# EasyEDA Pro project PCB File.epro

# Board Rev1
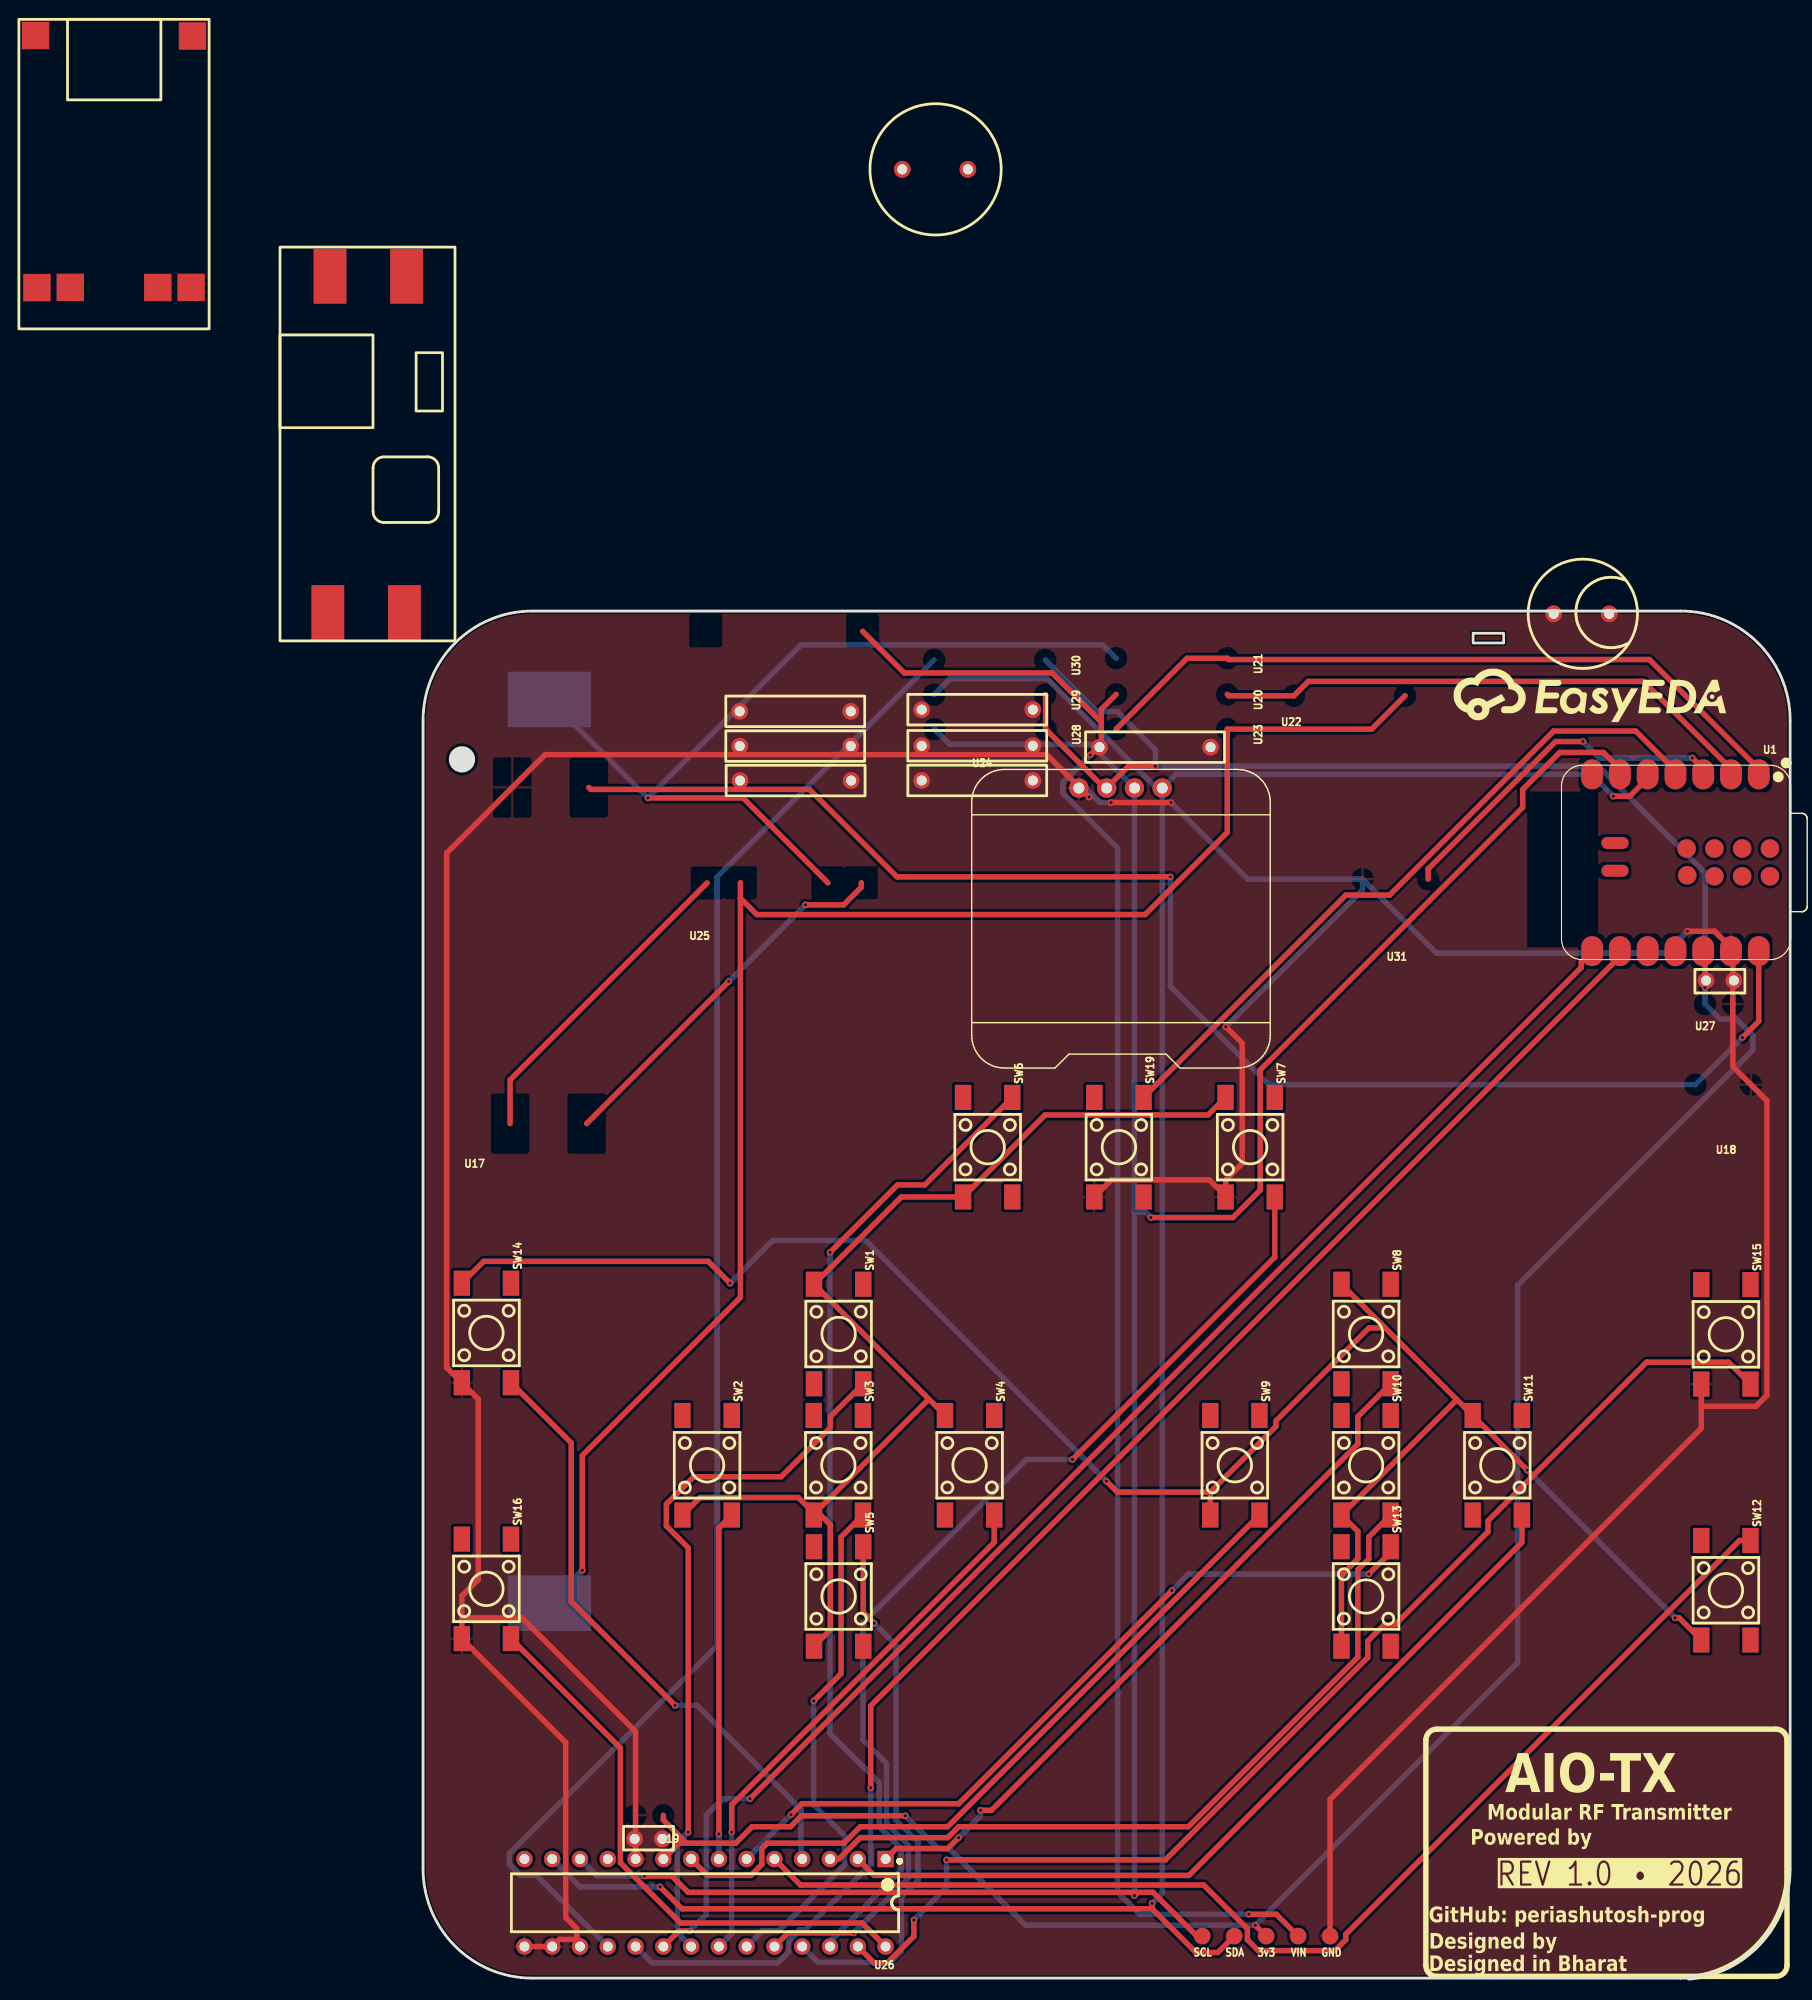
[diagram p0: board, top side]
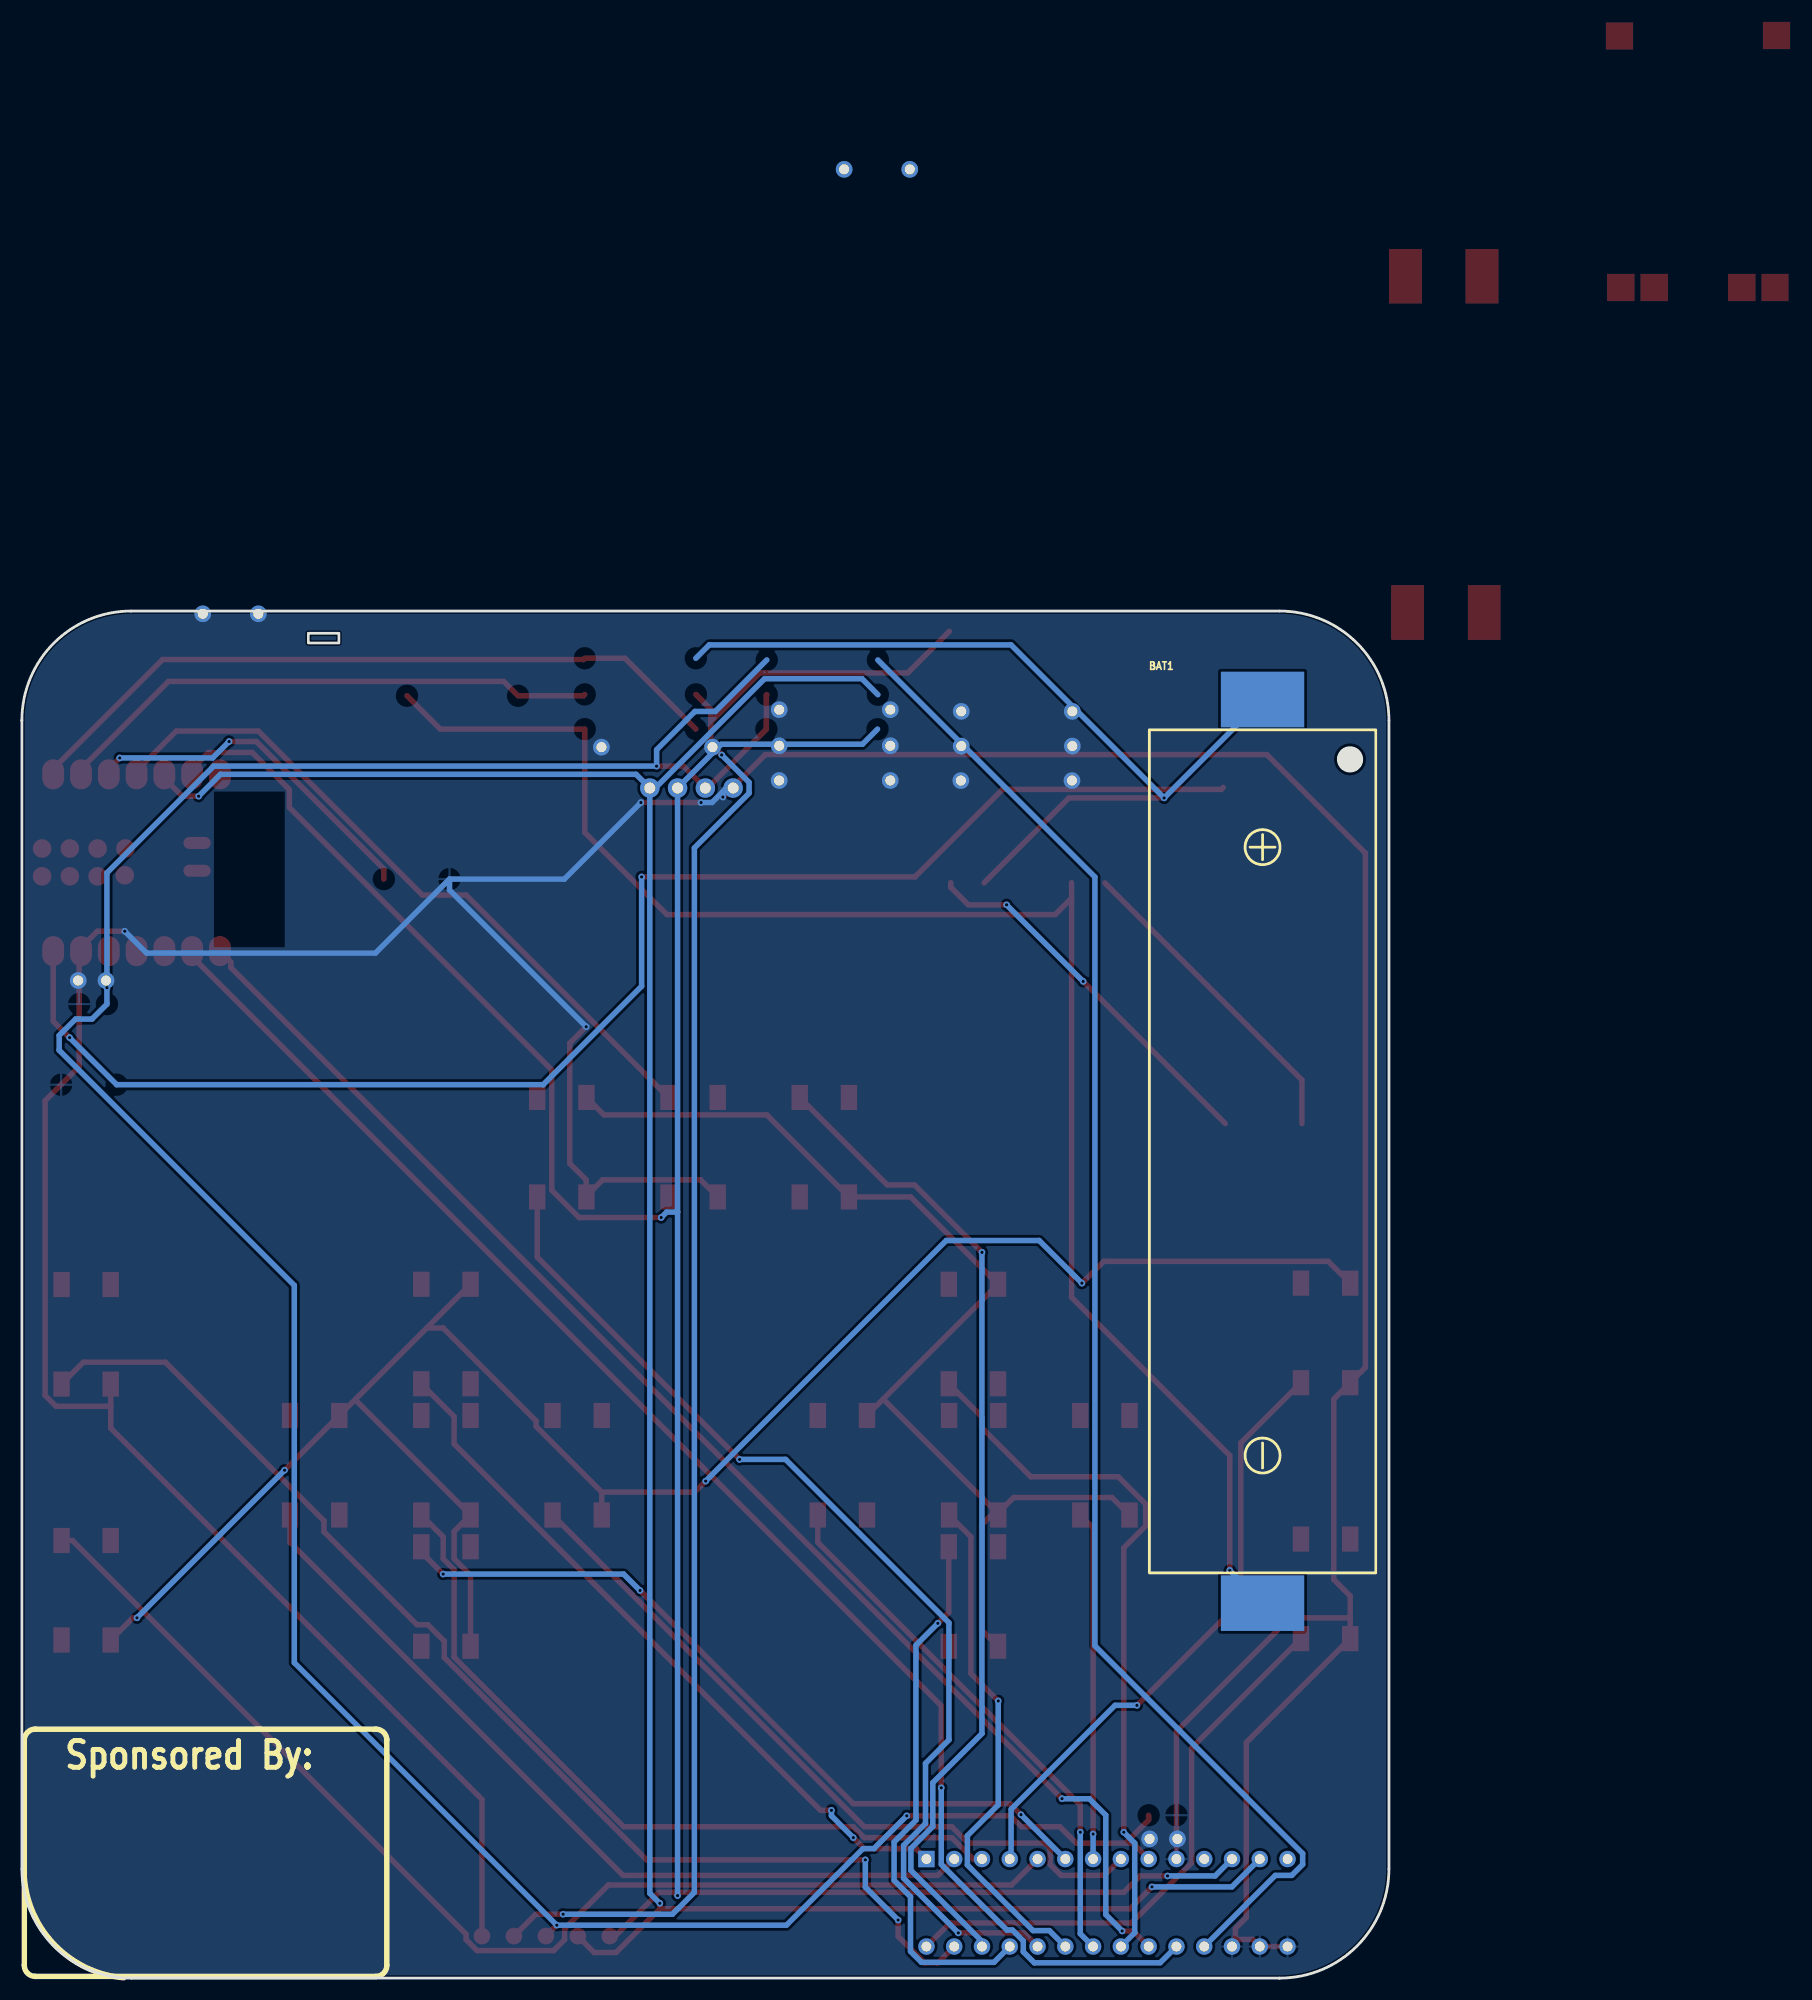
[diagram p1: board, bottom side, seen from below]

Outline 125 x 125 mm; copper layers: Top Layer, Bottom Layer. Coordinates in mm from the lower left corner of the outline.
Outline path: rectangle 96.01,122.97 98.81,122.08 ; 0,115 0,10 arc(2.93,2.93) 10,0 115,0 arc(122.07,2.93) 125,10 125,115 arc(122.07,122.07) 115,125 10,125 arc(2.93,122.07) 0,115
Stack: Top Layer 0.035mm / Dielectric1 1.51mm FR4 er 4.5 / Bottom Layer 0.035mm

## Design rules (mm)
spacing copperThickness1oz (default): track to track 0.102, other pairs 0.152 to 0.3
spacing copperThickness2oz: track to track 0.203, other pairs 0.152 to 0.3
spacing Plane_innerPlane: track to track 0.102, other pairs 0.152 to 0.3
spacing Copper_copperRegion: track to track 0.102, other pairs 0.152 to 0.3
track width copperThickness1oz (default): min 0.5, default 0.5, max 2.54
track width copperThickness2oz: min 0.203, default 0.254, max 2.54
differential pair differentialPair (default): width min 0.127, default 0.254, max 2.54; gap min 0.152, default 0.152

## Placement (name value [footprint] x y rotation side)
BAT1  BH-18650-B6AA002  [BATTERY-SMD_18650-1S-L77.1-W20.7-1]  11.56 75.6 180 bottom
NOREF  -  [Pad_e207]  71.25 3.84 0 top
NOREF#2  -  [Pad_e205]  77.09 3.84 0 top
NOREF#3  -  [Pad_e203]  82.93 3.84 0 top
NOREF#4  -  [Pad_e206]  74.17 3.84 0 top
NOREF#5  -  [Pad_e204]  80.01 3.84 0 top
SW1  TS-1102S-6x6x6-250  [SW-SMD_4P-L6.0-W6.0-P4.50-LS9.0-2]  38 58.89 270 top
SW2  TS-1102S-6x6x6-250  [SW-SMD_4P-L6.0-W6.0-P4.50-LS9.0-2]  25.97 46.89 270 top
SW3  TS-1102S-6x6x6-250  [SW-SMD_4P-L6.0-W6.0-P4.50-LS9.0-2]  37.97 46.89 270 top
SW4  TS-1102S-6x6x6-250  [SW-SMD_4P-L6.0-W6.0-P4.50-LS9.0-2]  49.97 46.89 270 top
SW5  TS-1102S-6x6x6-250  [SW-SMD_4P-L6.0-W6.0-P4.50-LS9.0-2]  38 34.89 270 top
SW6  TS-1102S-6x6x6-250  [SW-SMD_4P-L6.0-W6.0-P4.50-LS9.0-2]  51.63 75.98 270 top
SW7  TS-1102S-6x6x6-250  [SW-SMD_4P-L6.0-W6.0-P4.50-LS9.0-2]  75.63 75.98 270 top
SW8  TS-1102S-6x6x6-250  [SW-SMD_4P-L6.0-W6.0-P4.50-LS9.0-2]  86.23 58.89 270 top
SW9  TS-1102S-6x6x6-250  [SW-SMD_4P-L6.0-W6.0-P4.50-LS9.0-2]  74.23 46.89 270 top
SW10  TS-1102S-6x6x6-250  [SW-SMD_4P-L6.0-W6.0-P4.50-LS9.0-2]  86.23 46.89 270 top
SW11  TS-1102S-6x6x6-250  [SW-SMD_4P-L6.0-W6.0-P4.50-LS9.0-2]  98.23 46.89 270 top
SW12  TS-1102S-6x6x6-250  [SW-SMD_4P-L6.0-W6.0-P4.50-LS9.0-2]  119.13 35.46 270 top
SW13  TS-1102S-6x6x6-250  [SW-SMD_4P-L6.0-W6.0-P4.50-LS9.0-2]  86.23 34.89 270 top
SW14  TS-1102S-6x6x6-250  [SW-SMD_4P-L6.0-W6.0-P4.50-LS9.0-2]  5.79 58.99 270 top
SW15  TS-1102S-6x6x6-250  [SW-SMD_4P-L6.0-W6.0-P4.50-LS9.0-2]  119.13 58.86 270 top
SW16  TS-1102S-6x6x6-250  [SW-SMD_4P-L6.0-W6.0-P4.50-LS9.0-2]  5.79 35.59 270 top
SW19  TS-1102S-6x6x6-250  [SW-SMD_4P-L6.0-W6.0-P4.50-LS9.0-2]  63.63 75.98 270 top
U1  -  [XIAO-ESP32-C6-SMD]  104.01 110.9 270 top
U17  -  [MT3608 module]  11.56 93.5 0 top
U18  -  [1000uF Capacitor]  118.87 81.69 0 top
U19  -  [0.1uF Cap Footprint]  19.43 14.89 180 top
U20  -  [1/4W Resistor]  68.45 117.38 90 top
U21  -  [1/4W Resistor]  68.45 120.68 90 top
U22  -  [1/4W Resistor]  84.71 117.25 90 top
U23  -  [1/4W Resistor]  68.45 114.2 90 top
U24  OLED 0.96 I2C  [OLED 0.96 I2C GND-VCC]  64.13 97.19 0 top
U25  -  [TP4056 Module Footprint]  33.02 111.66 0 top
U26  MCP23017-E/SP  [DIP-28_L34.6-W7.3-P2.54-LS10.2-BL]  25.78 6.89 180 top
U27  -  [0.1uF Cap Footprint]  119.76 89.06 0 top
U28  -  [1/4W Resistor]  51.84 114.2 90 top
U29  -  [1/4W Resistor]  51.81 117.35 90 top
U30  -  [1/4W Resistor]  51.81 120.53 90 top
U31  -  [Buzzer 5v 5mm Pitch Footprint]  88.9 100.49 0 top

## Footprints (pads in the part's own frame, mm; a bottom-side part is the same pattern mirrored in y, then rotated)
0.1uF Cap Footprint
  round 1.524 hole 0.914: 1(-2.453,2.159) 2(0.087,2.159)
1/4W Resistor
  round 1.524 hole 0.914: 1(-4.699,22.86) 2(-4.699,12.7)
1000uF Capacitor
  round 1.524 hole 0.914: 1(-15.494,43.053) 2(-10.414,43.053)
BATTERY-SMD_18650-1S-L77.1-W20.7-1
  rect 7.62x5.08 smd: 1(0,-41.313) 2(0,41.313)
Buzzer 5v 5mm Pitch Footprint
  round 1.524 hole 0.914: 1(-45.085,64.897) 2(-39.085,64.897)
DIP-28_L34.6-W7.3-P2.54-LS10.2-BL
  rect 1.5x1.5 hole 0.9: 1(-16.51,-4)
  round 1.5 hole 0.9: 2(-13.97,-4) 3(-11.43,-4) 4(-8.89,-4) 5(-6.35,-4) 6(-3.81,-4) 7(-1.27,-4) 8(1.27,-4) 9(3.81,-4) 10(6.35,-4) 11(8.89,-4) 12(11.43,-4) 13(13.97,-4) 14(16.51,-4) 15(16.51,4) 16(13.97,4) 17(11.43,4) 18(8.89,4) 19(6.35,4) 20(3.81,4) 21(1.27,4) 22(-1.27,4) 23(-3.81,4) 24(-6.35,4) 25(-8.89,4) 26(-11.43,4) 27(-13.97,4) 28(-16.51,4)
MT3608 module
  rect 3x5 smd: 1(-20.264,31.369) 2(-13.264,31.369) 3(-13.066,62.103) 4(-20.066,62.103)
OLED 0.96 I2C GND-VCC
  round 1.778 hole 1: GND(-4.17,11.63) SCL(0.91,11.63) SDA(3.45,11.63) VCC(-1.63,11.63)
Pad_e203
  round 1.524 smd: 1(0,0)
Pad_e204
  round 1.524 smd: 1(0,0)
Pad_e205
  round 1.524 smd: 1(0,0)
Pad_e206
  round 1.524 smd: 1(0,0)
Pad_e207
  round 1.524 smd: 1(0,0)
SW-SMD_4P-L6.0-W6.0-P4.50-LS9.0-2
  rect 2.3x1.5 smd: 1(-4.55,2.25) 2(4.55,2.25) 3(-4.55,-2.25) 4(4.55,-2.25)
TP4056 Module Footprint
  rect 2.5x2.5 smd: 1(-68.453,65.956) 2(-54.102,65.913) 3(-68.326,42.91) 4(-65.278,42.926) 5(-57.277,42.918) 6(-54.229,42.926)
XIAO-ESP32-C6-SMD
  rrect 2.75x2 smd: 1(0.835,18.12) 2(0.835,15.58) 3(0.835,13.04) 4(0.835,10.5) 5(0.835,7.96) 6(0.835,5.42) 7(0.835,2.88) 8(17,2.88) 9(17,5.42) 10(17,7.96) 11(17,10.5) 12(17,13.04) 13(17,15.58) 14(17,18.12)
  round 1.7 smd: 24(7.617,19.142) 25(10.156,19.142) 26(7.617,16.602) 27(10.156,16.602) 28(7.617,14.062) 29(10.156,14.062) 30(7.617,11.521) 31(10.064,11.579)
  rrect 1.1x2.5 smd: 32(7.109,4.968) 33(9.649,4.968)

## Nets
3V3: NOREF#2.1 U1.12 U19.1 U24.VCC U26.9 U27.1 U28.2 U29.2 U30.2
GND: NOREF#3.1 SW7.4 SW14.4 SW15.4 SW16.4 SW19.4 U1.13 U17.4 U18.2 U19.2 U24.GND U26.10 U26.15 U26.16 U26.17 U27.2 U31.1
VCC: NOREF#5.1 U20.1 U25.2
BAT+: BAT1.2 U21.1 U25.5
BAT-: BAT1.1 U22.2 U23.2 U25.4
GPA0: SW1.2 U26.21
GPA1: SW4.2 U26.22
GPA2: SW3.2 U26.23
GPA3: SW7.2 U26.24
GPA4: SW5.1 U26.25
GPA5: SW6.1 U26.26
GPA6: SW15.2 U26.27
GPA7: SW16.2 U26.28
GPB0: SW8.2 U26.1
GPB1: SW11.2 U26.2
GPB2: SW10.2 U26.3
GPB3: SW14.2 U26.4
GPB4: SW12.1 U26.5
GPB5: SW13.1 U26.6
GPB6: SW2.2 U26.7
GPB7: SW9.2 U26.8
SCL: NOREF.1 U1.6 U24.SCL U26.12 U28.1
SDA: NOREF#4.1 U1.5 U24.SDA U26.13 U29.1
$1N2849: U17.2 U25.6
$1N2853: U17.1 U25.3
$1N4001: U1.1 U21.2 U23.1
$1N4008: U1.2 U20.2 U22.1
$1N5953: U1.14 U17.3 U18.1
$1N6001: U1.8 U26.20
$1N6010: U1.9 U26.19
$1N6409: U26.18 U30.1
$1N6803: SW1.3 SW2.4 SW3.4 SW4.3 SW5.4 SW6.4 SW7.3
$1N7086: U1.3 U31.2
$1N7556: SW8.3 SW9.4 SW10.4 SW11.3 SW12.4 SW13.4 SW14.3
$1N8365: SW19.1 U1.4

Pads without a net: SW1 1 4; SW2 1 3; SW3 1 3; SW4 1 4; SW5 2 3; SW6 2 3; SW7 1; SW8 1 4; SW9 1 3; SW10 1 3; SW11 1 4; SW12 2 3; SW13 2 3; SW14 1; SW15 1 3; SW16 1 3; SW19 2 3; U1 7 10 11 24 25 26 27 28 29 30 31 32 33; U25 1; U26 11 14

## Via types
v1: diameter 0.61, hole 0.305, Top Layer to Bottom Layer, 48 vias

## Routing (per net, layer and track width the routed paths; a pad name or vN(x,y) marks a point on that pad's centre or on a via; arc(x,y) is an arc through that point)
3V3: length 271.4
  Top Layer w0.5: v1(117.22,90.56) 117.22,93.73 U1.12 ; 24.09,12.34 21.97,14.46 21.97,14.89 ; 24.09,12.34 28.59,12.34 30.09,13.84 33.59,13.84 34.59,14.84 v1(44.09,14.84) ; 24.09,12.34 23.42,12.34 U26.9 ; NOREF#2.1 v1(76.09,4.84) ; 56.89,117.35 56.92,117.32 56.92,114.2 62.31,108.82 U24.VCC 64.5,110.82 v1(66.96,110.82)
  Bottom Layer w0.5: v1(44.09,14.84) 47.09,11.84 48.09,11.84 55.09,4.84 v1(76.09,4.84) 100.09,28.84 100.09,63.34 121.59,84.84 121.59,86.19 120.09,87.69 118.59,87.69 117.22,89.06 v1(117.22,90.56) 117.22,101.06 107.46,110.82 v1(66.96,110.82) 66.96,112.32 63.46,115.82 61.6,115.82 56.89,120.53
GND: length 437.1
  Top Layer w0.5: 3.54,32.94 9.04,32.94 19.43,22.56 U26.10 ; 3.54,32.94 3.54,34.94 5.04,36.44 5.04,52.94 SW14.4 2.16,55.83 2.16,102.87 11.16,111.87 57.02,111.87 v1(60.9,107.99) ; 3.54,32.94 SW16.4 13.04,21.54 13.04,5.54 14.04,4.54 14.04,3.54 ; v1(73.4,86.99) 74.9,85.49 74.9,74.49 73.4,72.99 73.4,71.49 ; 116.88,52.29 SW15.4 ; 116.88,52.29 121.88,52.29 122.88,53.29 122.88,80.23 119.76,83.34 119.76,93.56 119.59,93.73 119.59,94.23 118.09,95.73 v1(115.59,95.73) ; 116.88,52.29 116.88,50.29 82.93,16.34 NOREF#3.1 ; U26.17 14.04,3.2 14.04,3.54 ; U26.15 U26.16 12.46,3.54 14.04,3.54 ; 73.4,71.49 71.9,72.99 62.94,72.99 SW19.4 ; 73.4,71.49 SW7.4 ; v1(68.4,107.49) v1(62.9,107.49)
  Bottom Layer w0.5: 60.9,108.49 61.9,107.49 v1(62.9,107.49) ; 60.9,108.49 v1(60.9,107.99) ; 60.9,108.49 60.57,108.82 U24.GND ; 85.9,100.49 85.9,99.49 v1(73.4,86.99) ; 85.9,100.49 92.66,93.73 113.59,93.73 v1(115.59,95.73) ; 85.9,100.49 75.4,100.49 v1(68.4,107.49)
VCC: length 157
  Top Layer w0.5: v1(61.01,111.84) 62.01,112.84 62.01,114.84 ; 40.2,123.14 44,119.34 57.51,119.34 62.01,114.84 ; v1(75.51,5.84) 78.01,5.84 NOREF#5.1 ; 63.37,117.38 62.01,116.02 62.01,114.84
  Bottom Layer w0.5: v1(61.01,111.84) 58.51,109.34 58.51,108.34 63.51,103.34 63.51,7.84 65.51,5.84 v1(75.51,5.84)
BAT+: length 81.5
  Top Layer w0.5: 37.02,100.15 29.26,107.91 v1(20.56,107.91)
  Bottom Layer w0.5: 63.37,120.68 62.15,121.91 34.56,121.91 v1(20.56,107.91) BAT1.2
BAT-: length 148.3
  Top Layer w0.5: 29.02,98.75 30.52,97.25 66.02,97.25 73.53,104.76 73.53,114.2 86.74,114.2 89.79,117.25 ; 29.02,98.75 29.02,100.16 ; 29.02,98.75 29.02,62.25 14.56,47.78 v1(14.56,37.28)
  Bottom Layer w0.5: BAT1.1 v1(14.56,37.28)
GPA0: length 65.4
  Top Layer w0.5: SW1.2 37.25,51.34 37.25,50.34 32.75,45.84 24.75,45.84 22.25,43.34 22.25,41.34 24.25,39.34 v1(24.25,13.34)
  Bottom Layer w0.5: U26.21 23.25,4.16 23.25,12.34 v1(24.25,13.34)
GPA1: length 49.9
  Top Layer w0.5: SW4.2 52.22,39.84 28.22,15.84 v1(28.22,13.34)
  Bottom Layer w0.5: v1(28.22,13.34) 28.22,4.06 U26.22
GPA2: length 47.1
  Top Layer w0.5: SW3.2 38.22,40.34 38.22,27.84 v1(35.72,25.34)
  Bottom Layer w0.5: v1(35.72,25.34) 35.72,15.84 38.55,13.02 38.55,10.34 32.55,4.34 31.05,4.34 U26.23
GPA3: length 96.9
  Top Layer w0.5: SW7.2 77.88,65.93 v1(59.38,47.43) ; U26.24 33.38,4.14 v1(39.38,4.14)
  Bottom Layer w0.5: v1(59.38,47.43) 55.17,47.43 40.23,32.49 40.23,21.78 42.38,19.64 42.38,14.14 44.38,12.14 44.38,9.14 v1(39.38,4.14)
GPA4: length 49.8
  Top Layer w0.5: v1(41.25,32.44) 40.25,33.44 SW5.1
  Bottom Layer w0.5: U26.25 36.12,1.44 42.75,1.44 43.75,2.44 43.75,7.44 45.25,8.94 45.25,12.44 43.25,14.44 43.25,30.44 v1(41.25,32.44)
GPA5: length 91.4
  Top Layer w0.5: v1(37.21,66.36) 43.38,72.53 45.88,72.53 SW6.1
  Bottom Layer w0.5: U26.26 37.21,3.36 43.71,9.86 43.71,11.86 41.71,13.86 41.71,17.86 37.21,22.36 v1(37.21,66.36)
GPA6: length 109.6
  Top Layer w0.5: v1(44.88,5.31) 44.88,3.81 42.45,1.39 41.25,1.39 U26.27 ; SW15.2 119.38,56.31 111.88,56.31 97.38,41.81 97.38,40.81 88.88,32.31 87.88,32.31 86.38,30.81 86.38,29.31 67.88,10.81 v1(47.88,10.81)
  Bottom Layer w0.5: v1(47.88,10.81) 47.88,8.31 v1(44.88,5.31)
GPA7: length 52.1
  Top Layer w0.5: U26.28 40.14,5.04 23.54,5.04 18.04,10.54 18.04,21.04 SW16.2
GPB0: length 65.9
  Top Layer w0.5: v1(48.98,12.84) 47.98,11.84 43.25,11.84 U26.1 ; SW8.2 85.48,51.34 85.48,48.84 51.98,15.34 v1(50.98,15.34)
  Bottom Layer w0.5: v1(48.98,12.84) 50.98,14.84 v1(50.98,15.34)
GPB1: length 76.5
  Top Layer w0.5: U26.2 41.25,9.39 70.02,9.39 100.48,39.84 SW11.2
GPB2: length 70.2
  Top Layer w0.5: U26.3 38.02,10.89 39.98,12.84 47.98,12.84 48.98,13.84 69.98,13.84 85.48,29.34 85.48,37.34 86.48,38.34 86.48,40.34 SW10.2
GPB3: length 55.8
  Top Layer w0.5: v1(23.04,24.94) 13.54,34.44 13.54,48.94 SW14.2
  Bottom Layer w0.5: U26.4 34.54,11.02 34.54,15.44 25.04,24.94 v1(23.04,24.94)
GPB4: length 109.1
  Top Layer w0.5: SW12.1 120.38,40.02 84.38,4.01 84.38,3.51 83.38,2.51 76.38,2.51 75.38,3.51 75.38,4.51 71.38,8.51 34.51,8.51 U26.5
GPB5: length 71
  Top Layer w0.5: v1(68.48,35.44) 48.98,15.94 34.65,15.94 v1(33.65,14.94) ; SW13.1 88.48,38.94 v1(86.48,36.94)
  Bottom Layer w0.5: v1(86.48,36.94) 69.98,36.94 v1(68.48,35.44) ; v1(33.65,14.94) U26.6
GPB6: length 31.9
  Top Layer w0.5: SW2.2 27.05,41.17 v1(27.05,13.17)
  Bottom Layer w0.5: v1(27.05,13.17) U26.7
GPB7: length 67.1
  Top Layer w0.5: SW9.2 47.98,13.84 39.98,13.84 38.48,12.34 31.48,12.34 30.98,11.84 30.98,10.39 29.98,9.39 26.01,9.39 U26.8
SCL: length 252.7
  Top Layer w0.5: NOREF.1 70.75,3.84 66.75,7.84 65.25,7.84 ; U1.6 109.43,110.57 107.93,112.07 103.93,112.07 100.55,108.68 100.55,107.04 76.55,83.04 76.55,72.04 74.05,69.54 v1(66.55,69.54) ; 65.25,7.84 65.25,7.75 v1(65.05,7.54) ; 65.25,7.84 24.25,7.84 22.75,9.34 v1(20.25,9.34)
  Bottom Layer w0.5: 65.05,70.04 U24.SCL 61.05,112.82 48.15,112.82 46.76,114.2 ; 65.05,70.04 v1(65.05,7.54) ; 65.05,70.04 66.05,70.04 v1(66.55,69.54) ; U26.12 15.9,9.34 v1(20.25,9.34)
SDA: length 241.8
  Top Layer w0.5: 66.67,6.34 23.67,6.34 v1(21.67,8.34) ; 66.67,6.34 70.67,2.34 72.67,2.34 NOREF#4.1 ; 66.67,6.34 v1(66.67,6.84) ; v1(108.84,108.07) 110.34,108.07 111.84,109.57 111.84,109.93 U1.5
  Bottom Layer w0.5: U26.13 14.36,8.34 v1(21.67,8.34) ; U24.SDA 67.59,7.76 v1(66.67,6.84) ; U24.SDA 67.09,108.82 57.09,118.82 48.19,118.82 46.73,117.35 ; U24.SDA 68.84,110.07 106.84,110.07 v1(108.84,108.07)
$1N2849: length 34.5
  Top Layer w0.5: 14.96,78.14 v1(27.96,91.14) ; 40.07,100.16 40.07,99.75 38.46,98.14 v1(34.96,98.14)
  Bottom Layer w0.5: v1(27.96,91.14) v1(34.96,98.14)
$1N2853: length 29.5
  Top Layer w0.5: 7.96,78.14 7.96,82.13 25.97,100.14
$1N4001: length 66.1
  Top Layer w0.5: U1.1 122.13,110.57 112.13,120.57 73.65,120.57 73.53,120.68 69.85,120.68 63.37,114.2
$1N4008: length 50.5
  Top Layer w0.5: 119.59,110.07 119.59,110.57 111.59,118.57 80.94,118.57 79.63,117.25 73.66,117.25 73.53,117.38
$1N5953: length 132.9
  Top Layer w0.5: U1.14 122.13,87.49 v1(120.63,85.99) ; v1(68.33,100.69) 43.33,100.69 35.33,108.69 15.33,108.69 15.16,108.87
  Bottom Layer w0.5: v1(68.33,100.69) 68.33,90.69 77.33,81.69 116.33,81.69 v1(120.63,85.99)
$1N6001: length 128.2
  Top Layer w0.5: v1(29.89,16.4) 105.89,92.4 105.89,92.9 U1.8 ; v1(24.39,4.31) 23.39,4.31 U26.20
  Bottom Layer w0.5: v1(24.39,4.31) 25.89,5.81 25.89,14.9 27.39,16.4 v1(29.89,16.4)
$1N6010: length 138.3
  Top Layer w0.5: U1.9 109.43,93.4 40.93,24.9 v1(40.93,17.4)
  Bottom Layer w0.5: v1(40.93,17.4) 40.93,10.4 34.93,4.4 34.43,4.4 33.43,3.4 33.43,2.4 32.43,1.4 20.92,1.4 U26.19
$1N6409: length 138.3
  Bottom Layer w0.5: U26.18 10.39,9.39 8.89,9.39 7.89,10.39 7.89,11.39 26.89,30.39 26.89,100.69 46.73,120.53
$1N6803: length 103.4
  Top Layer w0.5: 36.25,42.44 37.25,41.44 37.25,31.84 SW5.4 ; 36.25,42.44 35.82,42.44 ; 36.25,42.44 36.25,42.94 46.25,52.94 ; 46.25,52.94 SW1.3 43.73,71.43 SW6.4 56.88,78.93 71.78,78.93 SW7.3 ; 46.25,52.94 47.72,51.47 SW4.3 ; 35.82,42.44 SW3.4 ; 35.82,42.44 34.32,43.94 25.33,43.94 SW2.4
$1N7086: length 32.4
  Top Layer w0.5: v1(106.05,113.07) 103.55,113.07 91.9,101.41 91.9,100.49 ; v1(116.05,111.57) 117.05,110.57 U1.3
  Bottom Layer w0.5: v1(106.05,113.07) 107.55,111.57 v1(116.05,111.57)
$1N7556: length 180.4
  Top Layer w0.5: 71.98,44.44 63.48,44.44 v1(62.48,45.44) ; 71.98,44.44 SW9.4 ; 71.98,44.44 77.98,50.44 77.98,50.94 86.48,59.44 87.98,59.44 ; 3.54,63.54 5.54,65.54 26.07,65.54 v1(28.07,63.54) ; SW13.4 83.98,36.84 85.48,38.34 85.48,40.84 SW10.4 94.48,52.84 94.48,52.94 ; v1(114.48,32.94) 114.85,32.94 SW12.4 ; v1(100.98,46.44) SW11.3 SW8.3
  Bottom Layer w0.5: v1(62.48,45.44) 40.48,67.44 31.98,67.44 v1(28.07,63.54) ; v1(100.98,46.44) v1(114.48,32.94)
$1N8365: length 64.3
  Top Layer w0.5: U1.4 114.51,110.39 110.88,114.03 103.38,114.03 88.38,99.03 84.38,99.03 SW19.1

## Copper pours and planes (outline as drawn; the poured copper is in the pictures)
GND on Top Layer: -5.84,128.18 129.54,128.18 129.54,-4.16 -5.84,-4.16
GND on Bottom Layer: -13.46,133.76 132.46,133.76 132.46,-8.35 -13.46,-8.35

## Text on the board
Bottom Silkscreen Layer: Sponsored By:
Top Solder Mask Layer: Ashutosh Peri | StrawberryOS
Top Silkscreen Layer: SCL | SDA | 3v3 | VIN | GND | AIO-TX | GitHub: periashutosh-prog | Designed in Bharat | Designed by | Powered by | Modular RF Transmitter | REV 1.0 • 2026
